# EasyEDA schematic shematic (easyeda file).json
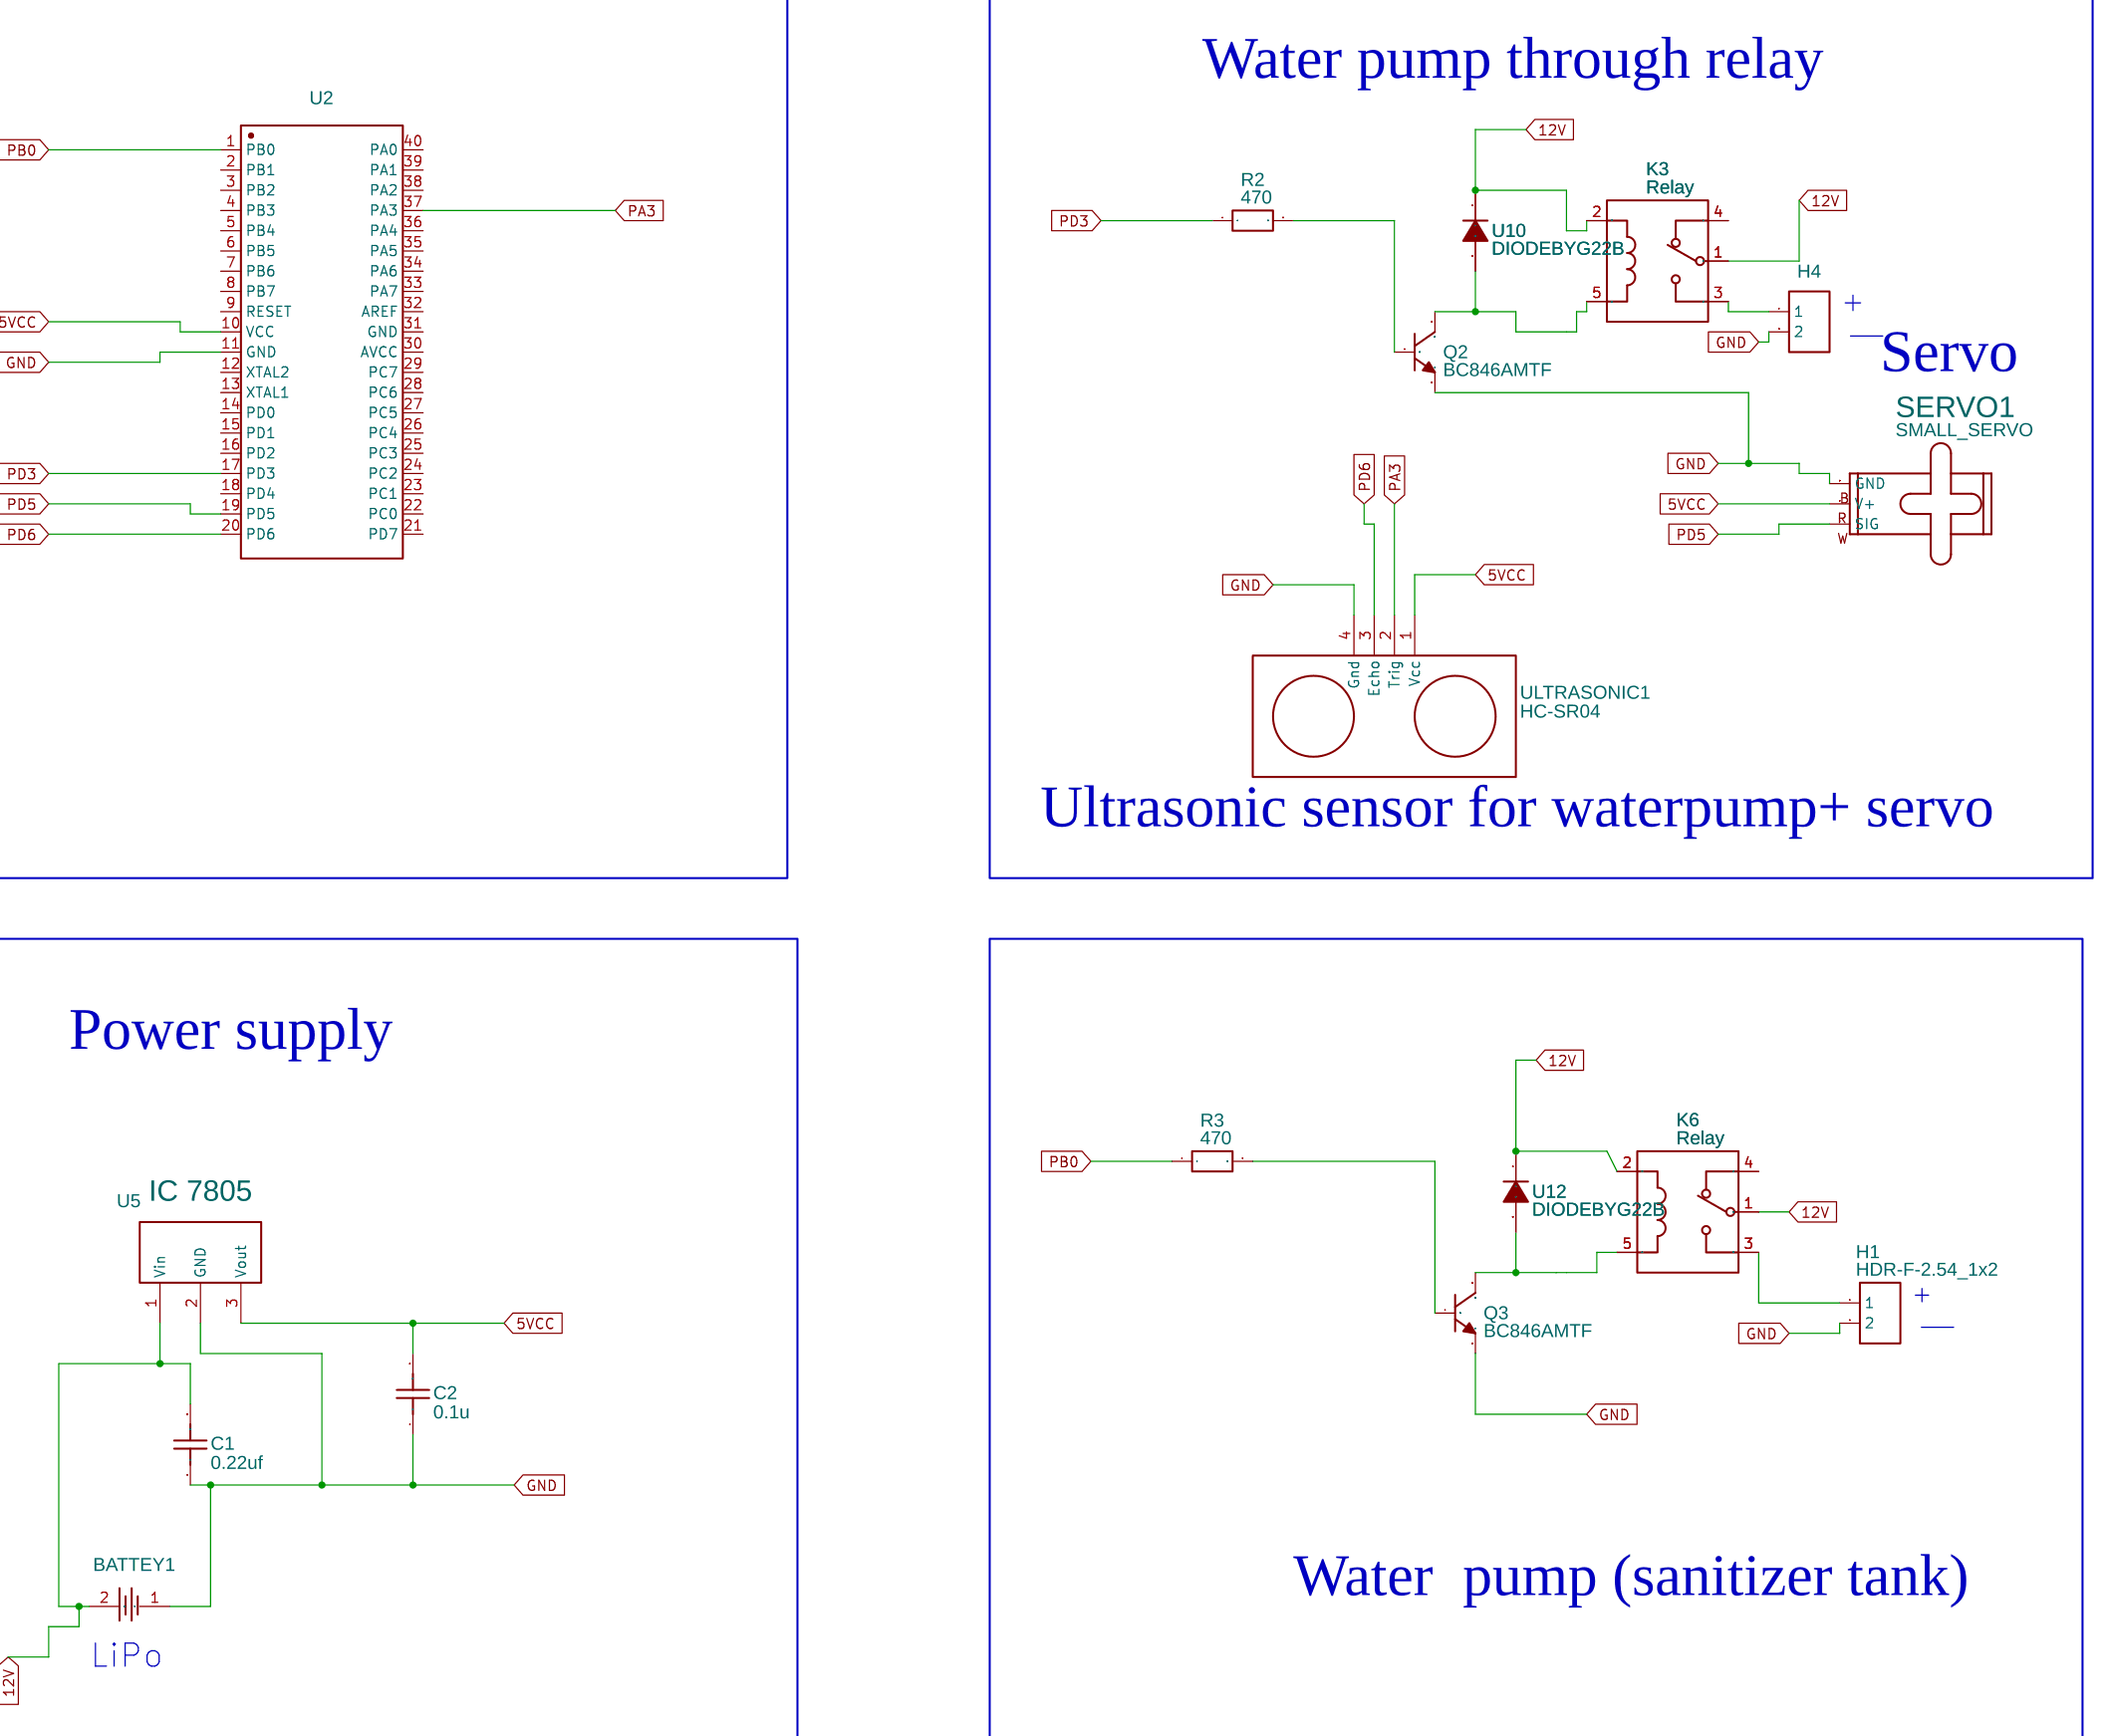
[diagram p0: schematic sheet]

## Parts
BATTEY1  BH-18650-B1BA002  [BATTERY-SMD_18650-1S-L77.1-W20.7-1]
C1  0.22uf  [C0603]
C2  0.1u  [C0603]
H1  HDR-F-2.54_1x2  [HDR-F-2.54_1X2]
H4  HDR-F-2.54_1x2  [HDR-F-2.54_1X2]
K3  Relay  [RELAY-TH_5PIN_HT3F-12VDC-SHG]
K6  Relay  [RELAY-TH_5PIN_HT3F-12VDC-SHG]
Q2  BC846AMTF  [SOT-23-3_L2.9-W1.3-P1.90-LS2.4-BR]
Q3  BC846AMTF  [SOT-23-3_L2.9-W1.3-P1.90-LS2.4-BR]
R2  470  [R0603]
R3  470  [R0603]
SERVO1  SMALL_SERVO  [1X03]
U2  ATMEGA32A-PU  [DIP-40]
U5  IC 7805  [PWRM-TH_K7805-500R2]
U10  DIODEBYG22B  [SMA_L4.3-W2.7-LS5.1-RD]
U12  DIODEBYG22B  [SMA_L4.3-W2.7-LS5.1-RD]
ULTRASONIC1  HC-SR04  [HCSR04]

## Library data of the parts
BATTEY1 = BH-18650-B1BA002: Supplier: LCSC; Supplier Part: C2988620; Manufacturer: MYOUNG(美阳); link: https://atta.szlcsc.com/upload/public/pdf/source/20220402/870DB99AB50CA0DF8D51CF7C86A51FAB.pdf; Contributor: lcsc; JLCPCB Part Class: Extended Part
C1 C2 = C_0603_US: Contributor: LCEDA_Lib
H1 H4 = HDR-F-2.54_1x2: Supplier Part: C49661; Supplier: LCSC; Contributor: LCEDA_Lib
K3 K6 = -: Supplier: LCSC; Manufacturer: HTV; Manufacturer Part: RelayHT3F-12VDC-SHG; image: //image.lceda.cn/szlcsc/C22022.jpg; Supplier Part: C22022
Q2 Q3 = BC846AMTF: Supplier: LCSC; Supplier Part: C184441; Manufacturer: ON Semicon; Contributor: LCSC; JLCPCB Part Class: Extended Part
R2 R3 = R_0603_EU: Contributor: LCEDA_Lib
SERVO1 = SMALL_SERVO: Small servo motor; Contributor: SparkFun
U2 = -: Supplier: LCSC; Manufacturer: MICROCHIP; image: //image.lceda.cn/szlcsc/C12703.jpg; Supplier Part: C12703
U5 = K78X6-500R2: Supplier: LCSC; Manufacturer: MORNSUN; Supplier Part: C64019; JLCPCB Part Class: Extended Part
U10 U12 = DIODEBYG22B: Supplier: LCSC; Supplier Part: C9900013935; Manufacturer: null; Manufacturer Part: DiodeBYG22B; JLCPCB Part Class: Extended Part; Contributor: lcsc
ULTRASONIC1 = HC-SR04: Contributor: allvex

## Nets
5VCC: C2.2 SERVO1.2(V+) U2.10(VCC) U5.3(Vout) ULTRASONIC1.1(Vcc)
12V: BATTEY1.2 C1.2 K3.1 K3.2 K6.1 K6.2 U5.1(Vin) U10.1(K) U12.1(K)
GND: BATTEY1.1 C1.1 C2.1 H1.2 H4.2 Q2.2(E) Q3.2(E) SERVO1.3(GND) U2.11(GND) U5.2(GND) ULTRASONIC1.4(Gnd)
PA3: U2.37(PA3) ULTRASONIC1.2(Trig)
PB0: R3.1 U2.1(PB0)
PD3: R2.1 U2.17(PD3)
PD5: SERVO1.1(SIG) U2.19(PD5)
PD6: U2.20(PD6) ULTRASONIC1.3(Echo)
Net-(H1-1): H1.1 K6.3
Net-(H4-1): H4.1 K3.3
Net-(K3-5): K3.5 Q2.3(C) U10.2(A)
Net-(K6-5): K6.5 Q3.3(C) U12.2(A)
Net-(Q2-1): Q2.1(B) R2.2
Net-(Q3-1): Q3.1(B) R3.2

Not connected (* = marked no-connect by the designer): K3 4; K6 4; U2 2(PB1) 3(PB2) 4(PB3) 5(PB4) 6(PB5) 7(PB6) 8(PB7) 9(RESET) 12(XTAL2) 13(XTAL1) 14(PD0) 15(PD1) 16(PD2) 18(PD4) 21(PD7) 22(PC0) 23(PC1) 24(PC2) 25(PC3) 26(PC4) 27(PC5) 28(PC6) 29(PC7) 30(AVCC) 31(GND) 32(AREF) 33(PA7) 34(PA6) 35(PA5) 36(PA4) 38(PA2) 39(PA1) 40(PA0)

## Notes on the sheet
- Schematic (205009E)
- Water pump through relay
- +
- -
- Servo
- Ultrasonic sensor for waterpump+ servo
- Power supply
- +
- -
- Water  pump (sanitizer tank)
- LiPo
